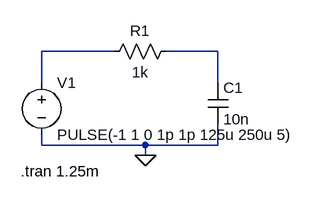
[diagram p0: schematic RC, 1k, 10n, Pulse 1V, 250us.asc]
RC, 1k, 10n, Pulse 1V, 250us.asc, the LTspice schematic file:
Version 4
SHEET 1 880 680
WIRE 208 64 96 64
WIRE 368 64 288 64
WIRE 96 112 96 64
WIRE 368 112 368 64
WIRE 96 208 96 192
WIRE 256 208 96 208
WIRE 368 208 368 176
WIRE 368 208 256 208
WIRE 256 224 256 208
FLAG 256 224 0
SYMBOL voltage 96 96 R0
WINDOW 123 0 0 Left 2
WINDOW 39 0 0 Left 2
SYMATTR InstName V1
SYMATTR Value PULSE(-1 1 0 1p 1p 125u 250u 5)
SYMBOL res 304 48 R90
WINDOW 0 0 56 VBottom 2
WINDOW 3 32 56 VTop 2
SYMATTR InstName R1
SYMATTR Value 1k
SYMBOL cap 352 112 R0
SYMATTR InstName C1
SYMATTR Value 10n
TEXT 64 248 Left 2 !.tran 1.25m

The netlist it stands for:
* RC, 1k, 10n, Pulse 1V, 250us.asc
V1 N001 0 PULSE(-1 1 0 1p 1p 125u 250u 5)
R1 N002 N001 1k
C1 N002 0 10n
.tran 1.25m
.backanno
.end